# Altium schematic sheet NBT_TopLevel.SCHDOC
size C; Organization: Altium Limited; Address1: L3, 12a Rodborough Rd; Address2: Frenchs Forest; Address3: NSW; Address4: Australia 2086; DocumentNumber: 1; SheetNumber: 1; SheetTotal: 12
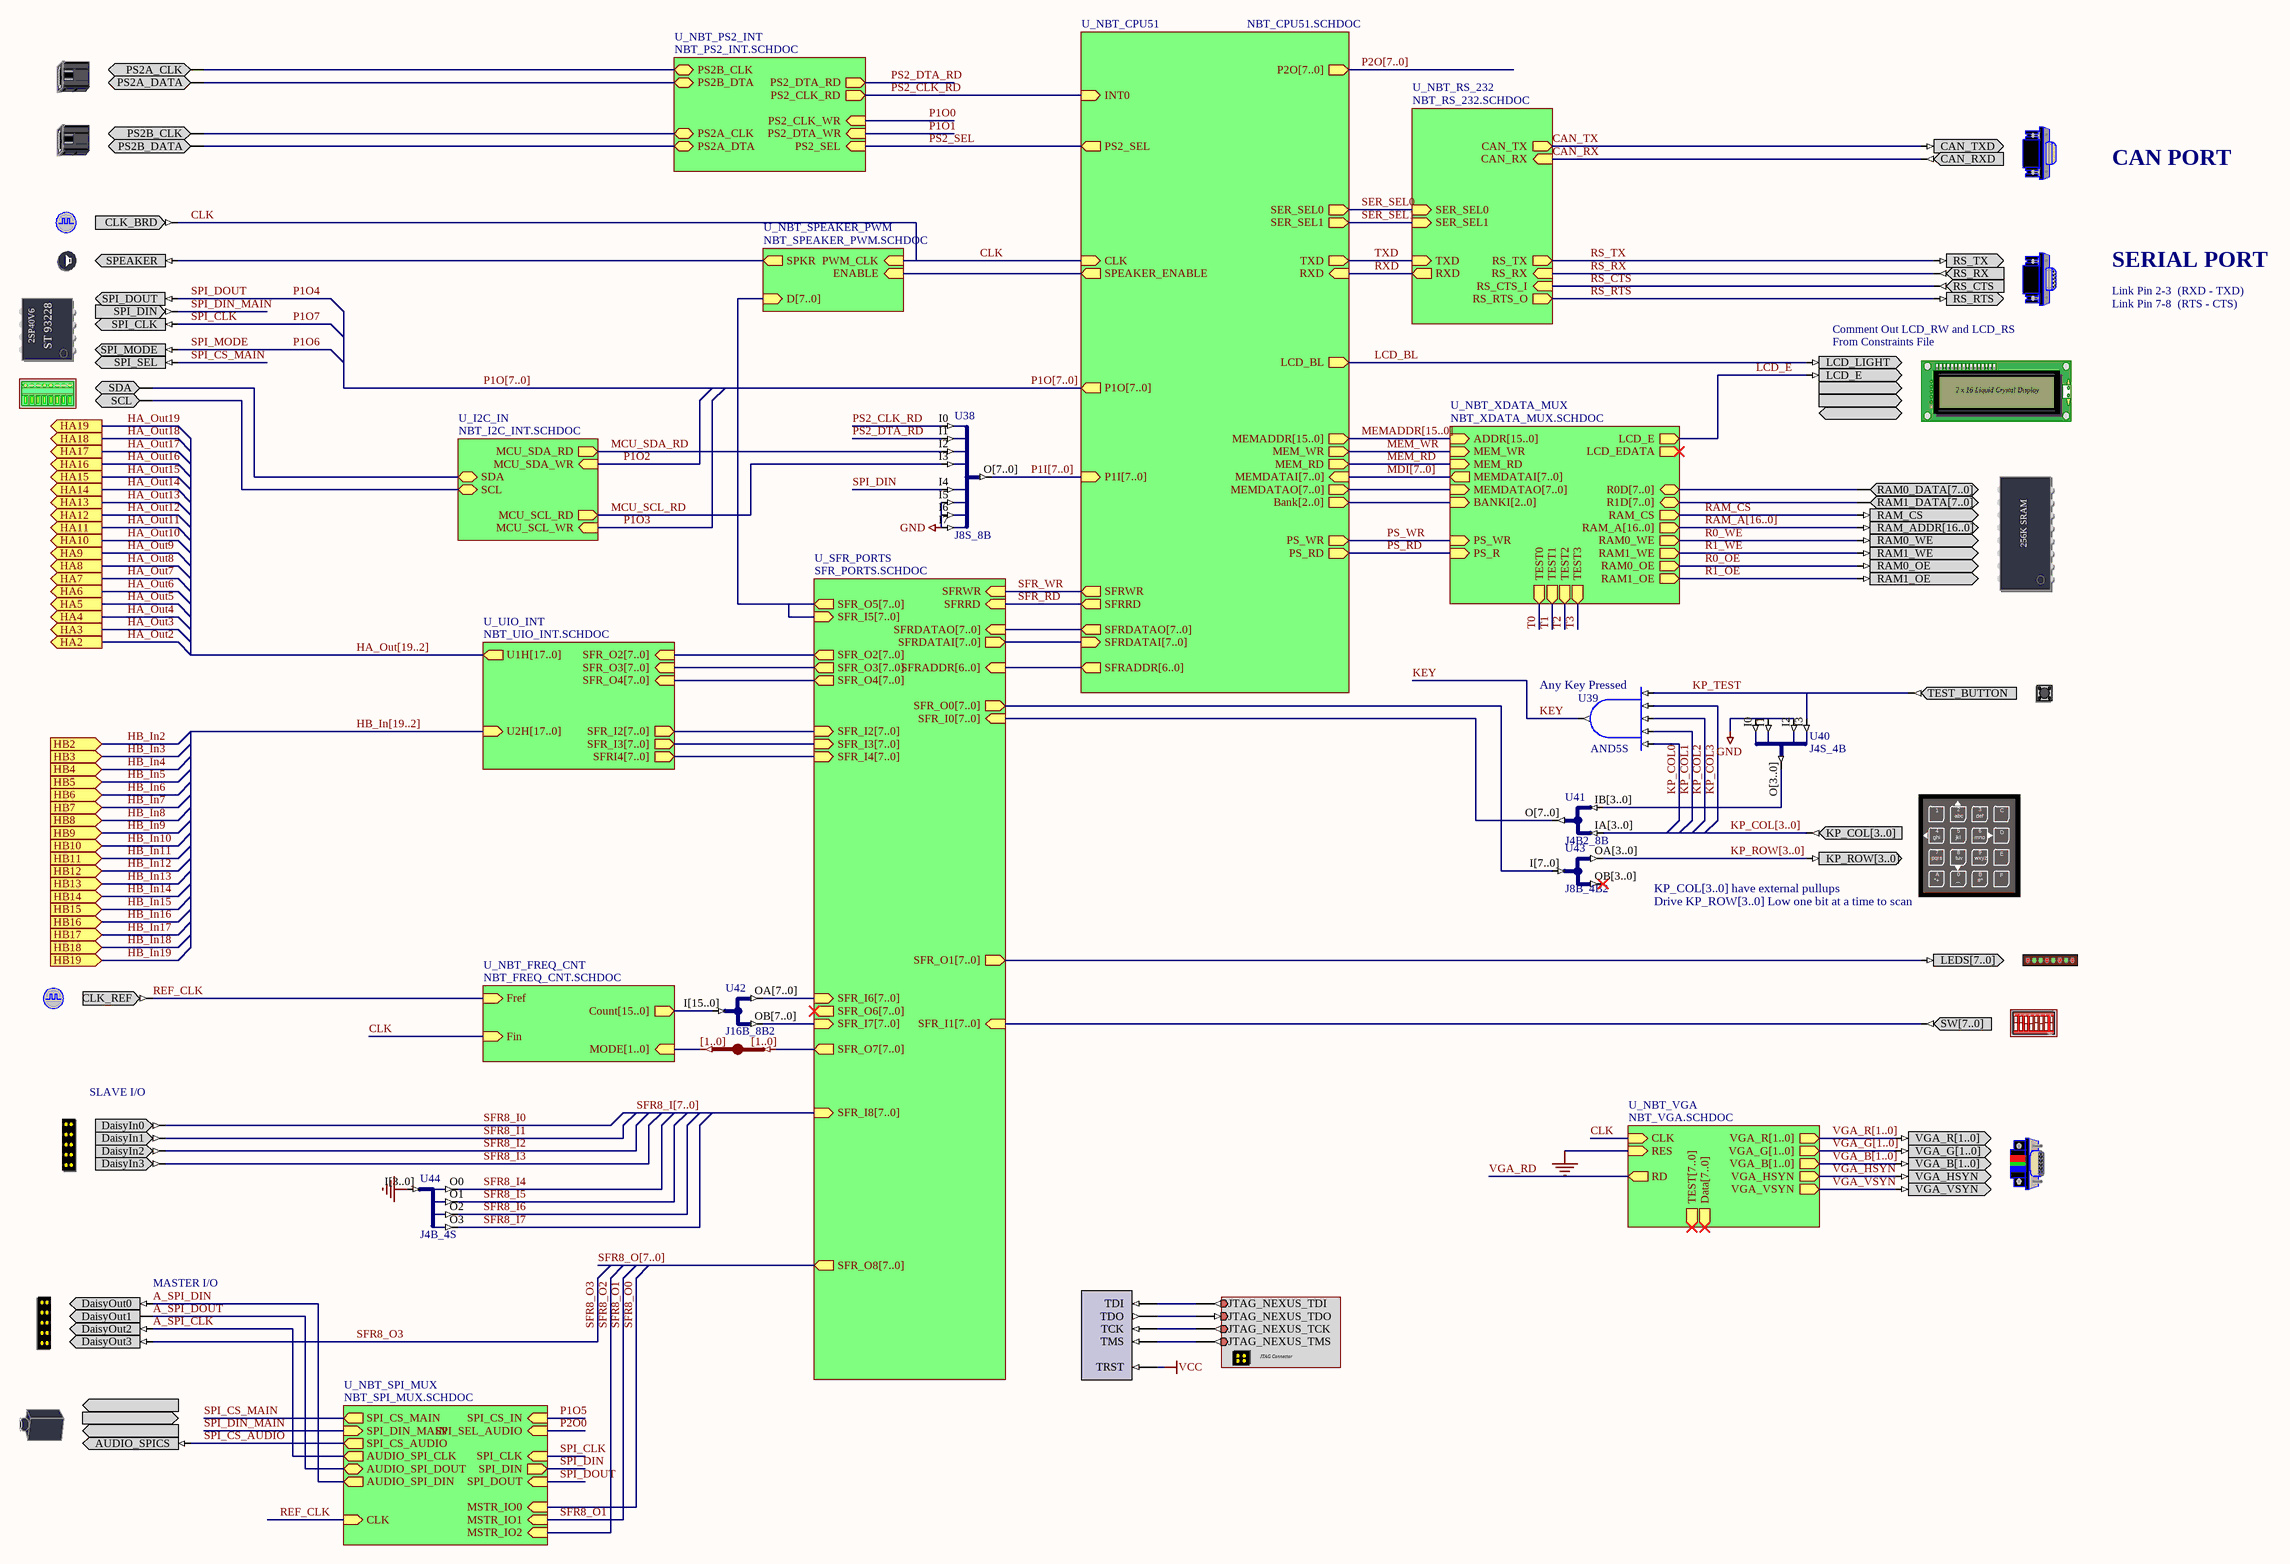
[diagram p0: NBT_TopLevel.SCHDOC]

## Parts
(Parts that share a designator on the sheet are numbered #1, #2 ... from top to bottom, then left to right.)
?#1  PS2A  (value not drawn)
?#2  PS2B  (value not drawn)
?#3  CANCNTR  (value not drawn)
?#4  CLOCK_BOARD  (value not drawn)
?#5  SPEAKER  (value not drawn)
?#6  RS232CNTR  (value not drawn)
?#7  SERIALFMEMORY  (value not drawn)
?#8  LCD  (value not drawn)
?#9  ADCDAC_I2C  (value not drawn)
?#10  MEMORY256KX8  (value not drawn)
?#11  TEST_BUTTON  (value not drawn)
?#12  KEYPAD  (value not drawn)
?#13  LED  (value not drawn)
?#14  CLOCK_REFERENCE  (value not drawn)
?#15  DIPSWITCH  (value not drawn)
?#16  DAISYIN_SLAVEIO  (value not drawn)
?#17  VGACNTR  (value not drawn)
?#18  DAISYOUT_MASTERIO  (value not drawn)
?#19  NEXUS_JTAG_CONNECTOR  (value not drawn)
?#20  AUDIO_DAC  (value not drawn)
JB_S2  IndexA: [1..0]  (hidden comment: JB)
NEXUS_JTAG_PORT  NEXUS_JTAG_PORT  (value not drawn)
U38  J8S_8B
U39  AND5S
U40  J4S_4B
U41  J4B2_8B
U42  J16B_8B2
U43  J8B_4B2
U44  J4B_4S

## Sub-sheets
U_I2C_IN = NBT_I2C_INT.SCHDOC: SDA (bidir), SCL (bidir), MCU_SDA_RD (out), MCU_SDA_WR (in), MCU_SCL_WR (in), MCU_SCL_RD (out)
U_NBT_CPU51 = NBT_CPU51.SCHDOC: CLK (in), RXD (in), TXD (out), MEMADDR[15..0] (out), MEM_WR (out), MEM_RD (out), Bank[2..0] (out), SFRDATAO[7..0] (out), SFRDATAI[7..0] (in), SFRWR (out), SFRRD (out), SFRADDR[6..0] (out), LCD_BL (out), INT0 (in), SPEAKER_ENABLE (out), P1O[7..0] (out), P1I[7..0] (in), MEMDATAO[7..0] (out), MEMDATAI[7..0] (in), PS_WR (out), PS_RD (out), PS2_SEL (out), SER_SEL0 (out), SER_SEL1 (out), P2O[7..0] (out)
U_NBT_FREQ_CNT = NBT_FREQ_CNT.SCHDOC: Fref (in), Fin (in), Count[15..0] (out), MODE[1..0] (in)
U_NBT_PS2_INT = NBT_PS2_INT.SCHDOC: PS2B_CLK (bidir), PS2B_DTA (bidir), PS2A_CLK (bidir), PS2A_DTA (bidir), PS2_CLK_WR (in), PS2_DTA_WR (in), PS2_CLK_RD (out), PS2_DTA_RD (out), PS2_SEL (in)
U_NBT_RS_232 = NBT_RS_232.SCHDOC: TXD (in), RXD (out), RS_TX (out), RS_CTS_I (in), RS_RX (in), RS_RTS_O (out), SER_SEL1 (in), CAN_RX (in), CAN_TX (out), SER_SEL0 (in)
U_NBT_SPEAKER_PWM = NBT_SPEAKER_PWM.SCHDOC: ENABLE (in), PWM_CLK (in), D[7..0] (in), SPKR (out)
U_NBT_SPI_MUX = NBT_SPI_MUX.SCHDOC: AUDIO_SPI_CLK (out), AUDIO_SPI_DOUT (bidir), AUDIO_SPI_DIN (out), MSTR_IO0 (in), MSTR_IO1 (in), MSTR_IO2 (in), SPI_CLK (in), SPI_DIN (out), SPI_DOUT (in), SPI_SEL_AUDIO (in), SPI_CS_IN (in), SPI_CS_MAIN (out), SPI_CS_AUDIO (out), SPI_DIN_MAIN (in), CLK (in)
U_NBT_VGA = NBT_VGA.SCHDOC: VGA_R[1..0] (out), VGA_G[1..0] (out), VGA_B[1..0] (out), VGA_HSYN (out), VGA_VSYN (out), CLK (in), RES (in), RD (out), Data[7..0] (out), TEST[7..0] (out)
U_NBT_XDATA_MUX = NBT_XDATA_MUX.SCHDOC: BANKI[2..0] (in), MEMDATAI[7..0] (out), RAM0_WE (out), RAM0_OE (out), RAM1_WE (out), RAM1_OE (out), RAM_CS (out), MEM_WR (in), MEM_RD (in), PS_WR (in), PS_R (in), ADDR[15..0] (in), TEST0 (out), TEST1 (out), TEST2 (out), TEST3 (out), MEMDATAO[7..0] (in), R0D[7..0] (bidir), R1D[7..0] (bidir), RAM_A[16..0] (out), LCD_EDATA (out), LCD_E (out)
U_SFR_PORTS = SFR_PORTS.SCHDOC: SFRDATAO[7..0] (in), SFRWR (in), SFRDATAI[7..0] (out), SFRRD (in), SFRADDR[6..0] (in), SFR_I0[7..0] (in), SFR_O0[7..0] (out), SFR_I1[7..0] (in), SFR_O1[7..0] (out), SFR_I2[7..0] (in), SFR_O2[7..0] (out), SFR_I3[7..0] (in), SFR_O3[7..0] (out), SFR_I4[7..0] (in), SFR_O4[7..0] (out), SFR_I5[7..0] (in), SFR_O5[7..0] (out), SFR_I6[7..0] (in), SFR_O6[7..0] (out), SFR_I7[7..0] (in), SFR_O7[7..0] (out), SFR_I8[7..0] (in), SFR_O8[7..0] (out)
U_UIO_INT = NBT_UIO_INT.SCHDOC: U2H[17..0] (in), SFR_I2[7..0] (out), SFR_I3[7..0] (out), SFRI4[7..0] (out), U1H[17..0] (out), SFR_O2[7..0] (in), SFR_O3[7..0] (in), SFR_O4[7..0] (in)

## Ports
HA2 (out), HA3 (out), HA4 (out), HA5 (out), HA6 (out), HA7 (out), HA8 (out), HA9 (out), HA10 (out), HA11 (out), HA12 (out), HA13 (out), HA14 (out), HA15 (out), HA16 (out), HA17 (out), HA18 (out), HA19 (out), HB2 (in), HB3 (in), HB4 (in), HB5 (in), HB6 (in), HB7 (in), HB8 (in), HB9 (in), HB10 (in), HB11 (in), HB12 (in), HB13 (in), HB14 (in), HB15 (in), HB16 (in), HB17 (in), HB18 (in), HB19 (in)

## Nets
GND: U38.I5 U38.I6 U38.I7 U40.I0 U40.I1 U40.I2 ; sheet U_NBT_VGA/RES
GNDBUS[..]: U44.I[3..0]
VCC: NEXUS_JTAG_PORT.TRST
A_SPI_CLK: ?#18.DaisyOut2 ; sheet U_NBT_SPI_MUX/AUDIO_SPI_CLK
A_SPI_DIN: ?#18.DaisyOut0 ; sheet U_NBT_SPI_MUX/AUDIO_SPI_DIN
A_SPI_DOUT: ?#18.DaisyOut1 ; sheet U_NBT_SPI_MUX/AUDIO_SPI_DOUT
CAN_RX: ?#3.CAN_RXD ; sheet U_NBT_RS_232/CAN_RX
CAN_TX: ?#3.CAN_TXD ; sheet U_NBT_RS_232/CAN_TX
CLK: ?#4.CLK_BRD ; sheet U_NBT_SPEAKER_PWM/PWM_CLK, sheet U_NBT_CPU51/CLK, sheet U_NBT_FREQ_CNT/Fin, sheet U_NBT_VGA/CLK
HA_Out2: port HA2
HA_Out3: port HA3
HA_Out4: port HA4
HA_Out5: port HA5
HA_Out6: port HA6
HA_Out7: port HA7
HA_Out8: port HA8
HA_Out9: port HA9
HA_Out10: port HA10
HA_Out11: port HA11
HA_Out12: port HA12
HA_Out13: port HA13
HA_Out14: port HA14
HA_Out15: port HA15
HA_Out16: port HA16
HA_Out17: port HA17
HA_Out18: port HA18
HA_Out19: port HA19
HB_In2: port HB2
HB_In3: port HB3
HB_In4: port HB4
HB_In5: port HB5
HB_In6: port HB6
HB_In7: port HB7
HB_In8: port HB8
HB_In9: port HB9
HB_In10: port HB10
HB_In11: port HB11
HB_In12: port HB12
HB_In13: port HB13
HB_In14: port HB14
HB_In15: port HB15
HB_In16: port HB16
HB_In17: port HB17
HB_In18: port HB18
HB_In19: port HB19
KEY: U39.O
KP_COL0: U39.I0
KP_COL1: U39.I1
KP_COL2: U39.I2
KP_COL3: U39.I3
KP_COL[3..0]: ?#12.KP_COL[3..0] U41.IA[3..0]
KP_ROW[3..0]: ?#12.KP_ROW[3..0] U43.OA[3..0]
KP_TEST: ?#11.TEST_BUTTON U39.I4 U40.I3
LCD_BL: ?#8.LCD_LIGHT ; sheet U_NBT_CPU51/LCD_BL
LCD_E: ?#8.LCD_E ; sheet U_NBT_XDATA_MUX/LCD_E
MCU_SCL_RD: U38.I3 ; sheet U_I2C_IN/MCU_SCL_RD
MCU_SDA_RD: U38.I2 ; sheet U_I2C_IN/MCU_SDA_RD
MEM_RD: sheet U_NBT_CPU51/MEM_RD, sheet U_NBT_XDATA_MUX/MEM_RD
MEM_WR: sheet U_NBT_CPU51/MEM_WR, sheet U_NBT_XDATA_MUX/MEM_WR
P1I[7..0]: U38.O[7..0] ; sheet U_NBT_CPU51/P1I[7..0]
P1O0: sheet U_NBT_PS2_INT/PS2_CLK_WR
P1O1: sheet U_NBT_PS2_INT/PS2_DTA_WR
P1O2: sheet U_I2C_IN/MCU_SDA_WR
P1O3: sheet U_I2C_IN/MCU_SCL_WR
P1O4: ?#7.SPI_DOUT ; sheet U_NBT_SPI_MUX/SPI_DOUT  [also labelled SPI_DOUT]
P1O5: sheet U_NBT_SPI_MUX/SPI_CS_IN
P1O6: ?#7.SPI_MODE  [also labelled SPI_MODE]
P1O7: ?#7.SPI_CLK ; sheet U_NBT_SPI_MUX/SPI_CLK  [also labelled SPI_CLK]
P2O0: sheet U_NBT_SPI_MUX/SPI_SEL_AUDIO
PS2_CLK_RD: U38.I0 ; sheet U_NBT_CPU51/INT0, sheet U_NBT_PS2_INT/PS2_CLK_RD
PS2_DTA_RD: U38.I1 ; sheet U_NBT_PS2_INT/PS2_DTA_RD
PS2_SEL: sheet U_NBT_CPU51/PS2_SEL, sheet U_NBT_PS2_INT/PS2_SEL
PS_RD: sheet U_NBT_CPU51/PS_RD, sheet U_NBT_XDATA_MUX/PS_R
PS_WR: sheet U_NBT_CPU51/PS_WR, sheet U_NBT_XDATA_MUX/PS_WR
R0_OE: ?#10.RAM0_OE ; sheet U_NBT_XDATA_MUX/RAM0_OE
R0_WE: ?#10.RAM0_WE ; sheet U_NBT_XDATA_MUX/RAM0_WE
R1_OE: ?#10.RAM1_OE ; sheet U_NBT_XDATA_MUX/RAM1_OE
R1_WE: ?#10.RAM1_WE ; sheet U_NBT_XDATA_MUX/RAM1_WE
RAM_A[16..0]: ?#10.RAM_ADDR[16..0] ; sheet U_NBT_XDATA_MUX/RAM_A[16..0]
RAM_CS: ?#10.RAM_CS ; sheet U_NBT_XDATA_MUX/RAM_CS
REF_CLK: ?#14.CLK_REF ; sheet U_NBT_FREQ_CNT/Fref, sheet U_NBT_SPI_MUX/CLK
RS_CTS: ?#6.RS_CTS ; sheet U_NBT_RS_232/RS_CTS_I
RS_RTS: ?#6.RS_RTS ; sheet U_NBT_RS_232/RS_RTS_O
RS_RX: ?#6.RS_RX ; sheet U_NBT_RS_232/RS_RX
RS_TX: ?#6.RS_TX ; sheet U_NBT_RS_232/RS_TX
RXD: sheet U_NBT_RS_232/RXD, sheet U_NBT_CPU51/RXD
SER_SEL0: sheet U_NBT_RS_232/SER_SEL0, sheet U_NBT_CPU51/SER_SEL0
SER_SEL1: sheet U_NBT_RS_232/SER_SEL1, sheet U_NBT_CPU51/SER_SEL1
SFR8_I0: ?#16.DaisyIn0
SFR8_I1: ?#16.DaisyIn1
SFR8_I2: ?#16.DaisyIn2
SFR8_I3: ?#16.DaisyIn3
SFR8_I4: U44.O0
SFR8_I5: U44.O1
SFR8_I6: U44.O2
SFR8_I7: U44.O3
SFR8_O0: sheet U_NBT_SPI_MUX/MSTR_IO0
SFR8_O1: sheet U_NBT_SPI_MUX/MSTR_IO1
SFR8_O2: sheet U_NBT_SPI_MUX/MSTR_IO2
SFR8_O3: ?#18.DaisyOut3
SFR_RD: sheet U_SFR_PORTS/SFRRD, sheet U_NBT_CPU51/SFRRD
SFR_WR: sheet U_SFR_PORTS/SFRWR, sheet U_NBT_CPU51/SFRWR
SPI_CS_AUDIO: ?#20.AUDIO_SPICS ; sheet U_NBT_SPI_MUX/SPI_CS_AUDIO
SPI_CS_MAIN: ?#7.SPI_SEL ; sheet U_NBT_SPI_MUX/SPI_CS_MAIN
SPI_DIN: U38.I4 ; sheet U_NBT_SPI_MUX/SPI_DIN
SPI_DIN_MAIN: ?#7.SPI_DIN ; sheet U_NBT_SPI_MUX/SPI_DIN_MAIN
T0: sheet U_NBT_XDATA_MUX/TEST0
T1: sheet U_NBT_XDATA_MUX/TEST1
T2: sheet U_NBT_XDATA_MUX/TEST2
T3: sheet U_NBT_XDATA_MUX/TEST3
TXD: sheet U_NBT_RS_232/TXD, sheet U_NBT_CPU51/TXD
VGA_B[1..0]: ?#17.VGA_B[1..0] ; sheet U_NBT_VGA/VGA_B[1..0]
VGA_G[1..0]: ?#17.VGA_G[1..0] ; sheet U_NBT_VGA/VGA_G[1..0]
VGA_HSYN: ?#17.VGA_HSYN ; sheet U_NBT_VGA/VGA_HSYN
VGA_R[1..0]: ?#17.VGA_R[1..0] ; sheet U_NBT_VGA/VGA_R[1..0]
VGA_RD: sheet U_NBT_VGA/RD
VGA_VSYN: ?#17.VGA_VSYN ; sheet U_NBT_VGA/VGA_VSYN
Net?#1_PS2A_CLK: ?#1.PS2A_CLK ; sheet U_NBT_PS2_INT/PS2B_CLK
Net?#1_PS2A_DATA: ?#1.PS2A_DATA ; sheet U_NBT_PS2_INT/PS2B_DTA
Net?#2_PS2B_CLK: ?#2.PS2B_CLK ; sheet U_NBT_PS2_INT/PS2A_CLK
Net?#2_PS2B_DATA: ?#2.PS2B_DATA ; sheet U_NBT_PS2_INT/PS2A_DTA
Net?#5_SPEAKER: ?#5.SPEAKER ; sheet U_NBT_SPEAKER_PWM/SPKR
Net?#9_SCL: ?#9.SCL ; sheet U_I2C_IN/SCL
Net?#9_SDA: ?#9.SDA ; sheet U_I2C_IN/SDA
Net?#10_RAM0_DATA[7..0]: ?#10.RAM0_DATA[7..0] ; sheet U_NBT_XDATA_MUX/R0D[7..0]
Net?#10_RAM1_DATA[7..0]: ?#10.RAM1_DATA[7..0] ; sheet U_NBT_XDATA_MUX/R1D[7..0]
Net?#13_LEDS[7..0]: ?#13.LEDS[7..0] ; sheet U_SFR_PORTS/SFR_O1[7..0]
Net?#15_SW[7..0]: ?#15.SW[7..0] ; sheet U_SFR_PORTS/SFR_I1[7..0]
Net?#19_JTAG_NEXUS_TCK: ?#19.JTAG_NEXUS_TCK NEXUS_JTAG_PORT.TCK
Net?#19_JTAG_NEXUS_TDI: ?#19.JTAG_NEXUS_TDI NEXUS_JTAG_PORT.TDI
Net?#19_JTAG_NEXUS_TDO: ?#19.JTAG_NEXUS_TDO NEXUS_JTAG_PORT.TDO
Net?#19_JTAG_NEXUS_TMS: ?#19.JTAG_NEXUS_TMS NEXUS_JTAG_PORT.TMS
NetJB_S2_A[0..0]: JB_S2.A[0..0] ; sheet U_NBT_FREQ_CNT/MODE[1..0]
NetJB_S2_B[0..0]: JB_S2.B[0..0] ; sheet U_SFR_PORTS/SFR_O7[7..0]
NetU40_O[3..0]: U40.O[3..0] U41.IB[3..0]
NetU41_O[7..0]: U41.O[7..0] ; sheet U_SFR_PORTS/SFR_I0[7..0]
NetU42_I[15..0]: U42.I[15..0] ; sheet U_NBT_FREQ_CNT/Count[15..0]
NetU42_OA[7..0]: U42.OA[7..0] ; sheet U_SFR_PORTS/SFR_I6[7..0]
NetU42_OB[7..0]: U42.OB[7..0] ; sheet U_SFR_PORTS/SFR_I7[7..0]
NetU43_I[7..0]: U43.I[7..0] ; sheet U_SFR_PORTS/SFR_O0[7..0]
(unnamed): sheet U_NBT_SPEAKER_PWM/ENABLE, sheet U_NBT_CPU51/SPEAKER_ENABLE

Not connected (* = marked no-connect by the designer): U43 OB[3..0]*

## Buses and harness runs
bus HA_Out[19..2] = sheet U_UIO_INT/U1H[17..0]
bus HB_In[19..2] = sheet U_UIO_INT/U2H[17..0]
bus KP_COL[3..0]
bus KP_ROW[3..0]
bus MDI[7..0] = sheet U_NBT_CPU51/MEMDATAI[7..0] = sheet U_NBT_XDATA_MUX/MEMDATAI[7..0]
bus MEMADDR[15..0] = sheet U_NBT_CPU51/MEMADDR[15..0] = sheet U_NBT_XDATA_MUX/ADDR[15..0]
bus P1I[7..0] = sheet U_NBT_CPU51/P1I[7..0]
bus P1O[7..0] = sheet U_NBT_CPU51/P1O[7..0]
bus P2O[7..0] = sheet U_NBT_CPU51/P2O[7..0]
bus RAM_A[16..0] = sheet U_NBT_XDATA_MUX/RAM_A[16..0]
bus SFR8_I[7..0] = sheet U_SFR_PORTS/SFR_I8[7..0]
bus SFR8_O[7..0] = sheet U_SFR_PORTS/SFR_O8[7..0]
bus sheet U_NBT_CPU51/Bank[2..0] = sheet U_NBT_XDATA_MUX/BANKI[2..0]
bus sheet U_NBT_CPU51/MEMDATAO[7..0] = sheet U_NBT_XDATA_MUX/MEMDATAO[7..0]
bus sheet U_NBT_CPU51/SFRADDR[6..0] = sheet U_SFR_PORTS/SFRADDR[6..0]
bus sheet U_NBT_CPU51/SFRDATAI[7..0] = sheet U_SFR_PORTS/SFRDATAI[7..0]
bus sheet U_NBT_CPU51/SFRDATAO[7..0] = sheet U_SFR_PORTS/SFRDATAO[7..0]
bus sheet U_NBT_SPEAKER_PWM/D[7..0] = sheet U_SFR_PORTS/SFR_I5[7..0] = sheet U_SFR_PORTS/SFR_O5[7..0]
bus sheet U_SFR_PORTS/SFR_I2[7..0] = sheet U_UIO_INT/SFR_I2[7..0]
bus sheet U_SFR_PORTS/SFR_I3[7..0] = sheet U_UIO_INT/SFR_I3[7..0]
bus sheet U_SFR_PORTS/SFR_I4[7..0] = sheet U_UIO_INT/SFRI4[7..0]
bus sheet U_SFR_PORTS/SFR_O2[7..0] = sheet U_UIO_INT/SFR_O2[7..0]
bus sheet U_SFR_PORTS/SFR_O3[7..0] = sheet U_UIO_INT/SFR_O3[7..0]
bus sheet U_SFR_PORTS/SFR_O4[7..0] = sheet U_UIO_INT/SFR_O4[7..0]
bus VGA_B[1..0] = sheet U_NBT_VGA/VGA_B[1..0]
bus VGA_G[1..0] = sheet U_NBT_VGA/VGA_G[1..0]
bus VGA_R[1..0] = sheet U_NBT_VGA/VGA_R[1..0]

## Notes on the sheet
- CAN PORT
- SERIAL PORT
- Comment Out LCD_RW and LCD_RS
- Link Pin 2-3  (RXD - TXD)
- Link Pin 7-8  (RTS - CTS)
- From Constraints File
- (near U39) Any Key Pressed
- KP_COL[3..0] have external pullups
- Drive KP_ROW[3..0] Low one bit at a time to scan
- SLAVE I/O
- MASTER I/O
- Title
- Size:
- Date:
- File:
- C
- Number:
- Time:
- Revision:
- Sheet
- of
- (in symbol DIPSWITCH) 8; 7; 6; 5; 4; 3; 2; 1; ON
- (in symbol KEYPAD) 1; 2; 3; C; abc; def; 4; 5; 6; ghi; jkl; mno; D; 7; 8; 9; E; pqrs; tuv; wxyz; A; 0; B; F; *+; (; #^
- (in symbol LCD) 2 x 16 Liquid Crystal Display
- (in symbol MEMORY256KX8) 256K SRAM
- (in symbol NEXUS_JTAG_CONNECTOR) JTAG Connector
- (in symbol SERIALFMEMORY) 2SP40V6; ST 93228

## Library data of the parts
?#1 = PS2A: Mouse PS2 Connector; PortComponent: True; Published: 19-Nov-2003; Publisher: Altium Limited
?#2 = PS2B: Key Board PS2 Connector; PortComponent: True; Published: 19-Nov-2003; Publisher: Altium Limited
?#3 = CANCNTR: CAN Bus Connector; PortComponent: True; Published: 19-Nov-2003; Publisher: Altium Limited
?#4 = CLOCK_BOARD: Global System Clock Supply; PortComponent: True; Published: 19-Nov-2003; Publisher: Altium Limited
?#5 = SPEAKER: Sound interface; PortComponent: True; Published: 19-Nov-2003; Publisher: Altium Limited
?#6 = RS232CNTR: DCE Serial Port Connector; PortComponent: True; Published: 19-Nov-2003; Publisher: Altium Limited
?#7 = SERIALFMEMORY: Serial Flash Memory; PortComponent: True; Published: 19-Nov-2003; Publisher: Altium Limited
?#8 = LCD: Liquid Crystal Display; PortComponent: True; Published: 19-Nov-2003; Publisher: Altium Limited
?#9 = ADCDAC_I2C: Analog Digital/ Digital Analog Converter, I2C Interface; PortComponent: True; Published: 19-Nov-2003; Publisher: Altium Limited
?#10 = MEMORY256KX8: SRAM 256kx8; PortComponent: True; Published: 19-Nov-2003; Publisher: Altium Limited
?#11 = TEST_BUTTON: Test Button; PortComponent: True; Published: 19-Nov-2003; Publisher: Altium Limited
?#12 = KEYPAD: Key Pad; PortComponent: True; Published: 19-Nov-2003; Publisher: Altium Limited
?#13 = LED: 8-Way LEDS; PortComponent: True; Published: 19-Nov-2003; Publisher: Altium Limited
?#14 = CLOCK_REFERENCE: Global System Clock Reference Supply; PortComponent: True; Published: 19-Nov-2003; Publisher: Altium Limited
?#15 = DIPSWITCH: 8-Way Dip Switch; PortComponent: True; Published: 19-Nov-2003; Publisher: Altium Limited
?#16 = DAISYIN_SLAVEIO: Daisy Chain In; PortComponent: True; Published: 19-Nov-2003; Publisher: Altium Limited
?#17 = VGACNTR: VGA Dsub-15-Female-HD; PortComponent: True; Published: 19-Nov-2003; Publisher: Altium Limited
?#18 = DAISYOUT_MASTERIO: Daisy Chain Out; PortComponent: True; Published: 19-Nov-2003; Publisher: Altium Limited
?#19 = NEXUS_JTAG_CONNECTOR: JTAG Port; PortComponent: True; Published: 5-Sep-2003; Publisher: Altium Hobart Technology Centre
?#20 = AUDIO_DAC: Audio Jack; PortComponent: True; Published: 19-Nov-2003; Publisher: Altium Limited
JB_S2 = JB: System BUS Joiner; ArchiveName: GENERIC; Published: 18-Dec-2003; Publisher: Altium Limited; Core Revision: 1.00.00; IndexB: [1..0]
NEXUS_JTAG_PORT = NEXUS_JTAG_PORT: Nexus Processor JTAG Chain Connector; NEXUS_JTAG_CONNECTOR: True; Published: 5-Sep-2003; Publisher: Altium Hobart Technology Centre
U38 = J8S_8B: 8 Single pin inputs to single 8-Bit output bus; ArchiveName: GENERIC; Published: 7-Nov-2003; Publisher: Altium Limited; Core Revision: 1.00.00
U39 = AND5S: 5-Input AND Gate, Single Pin Version; Xilinx Equivalent: AND5; ArchiveName: GENERIC; Published: 7-Nov-2003; Publisher: Altium Limited; Core Revision: 1.00.00
U40 = J4S_4B: 4 Single pin inputs to single 4-Bit output bus; ArchiveName: GENERIC; Published: 7-Nov-2003; Publisher: Altium Limited; Core Revision: 1.00.00
U41 = J4B2_8B: 2 x 4-Bit input bus to 1 x 8-bit output bus; ArchiveName: GENERIC; Published: 7-Nov-2003; Publisher: Altium Limited; Core Revision: 1.00.00
U42 = J16B_8B2: 1 x 16-bit input bus to 2 x 8-Bit output bus; ArchiveName: GENERIC; Published: 7-Nov-2003; Publisher: Altium Limited; Core Revision: 1.00.00
U43 = J8B_4B2: 1 x 8-bit input bus to 2 x 4-Bit output bus; ArchiveName: GENERIC; Published: 7-Nov-2003; Publisher: Altium Limited; Core Revision: 1.00.00
U44 = J4B_4S: 4-Bit input bus to 4 Single pin outputs; ArchiveName: GENERIC; Published: 4-Dec-2003; Publisher: Altium Limited; Core Revision: 1.00.00